# EAGLE design untitled (EAGLE 9.6.2)
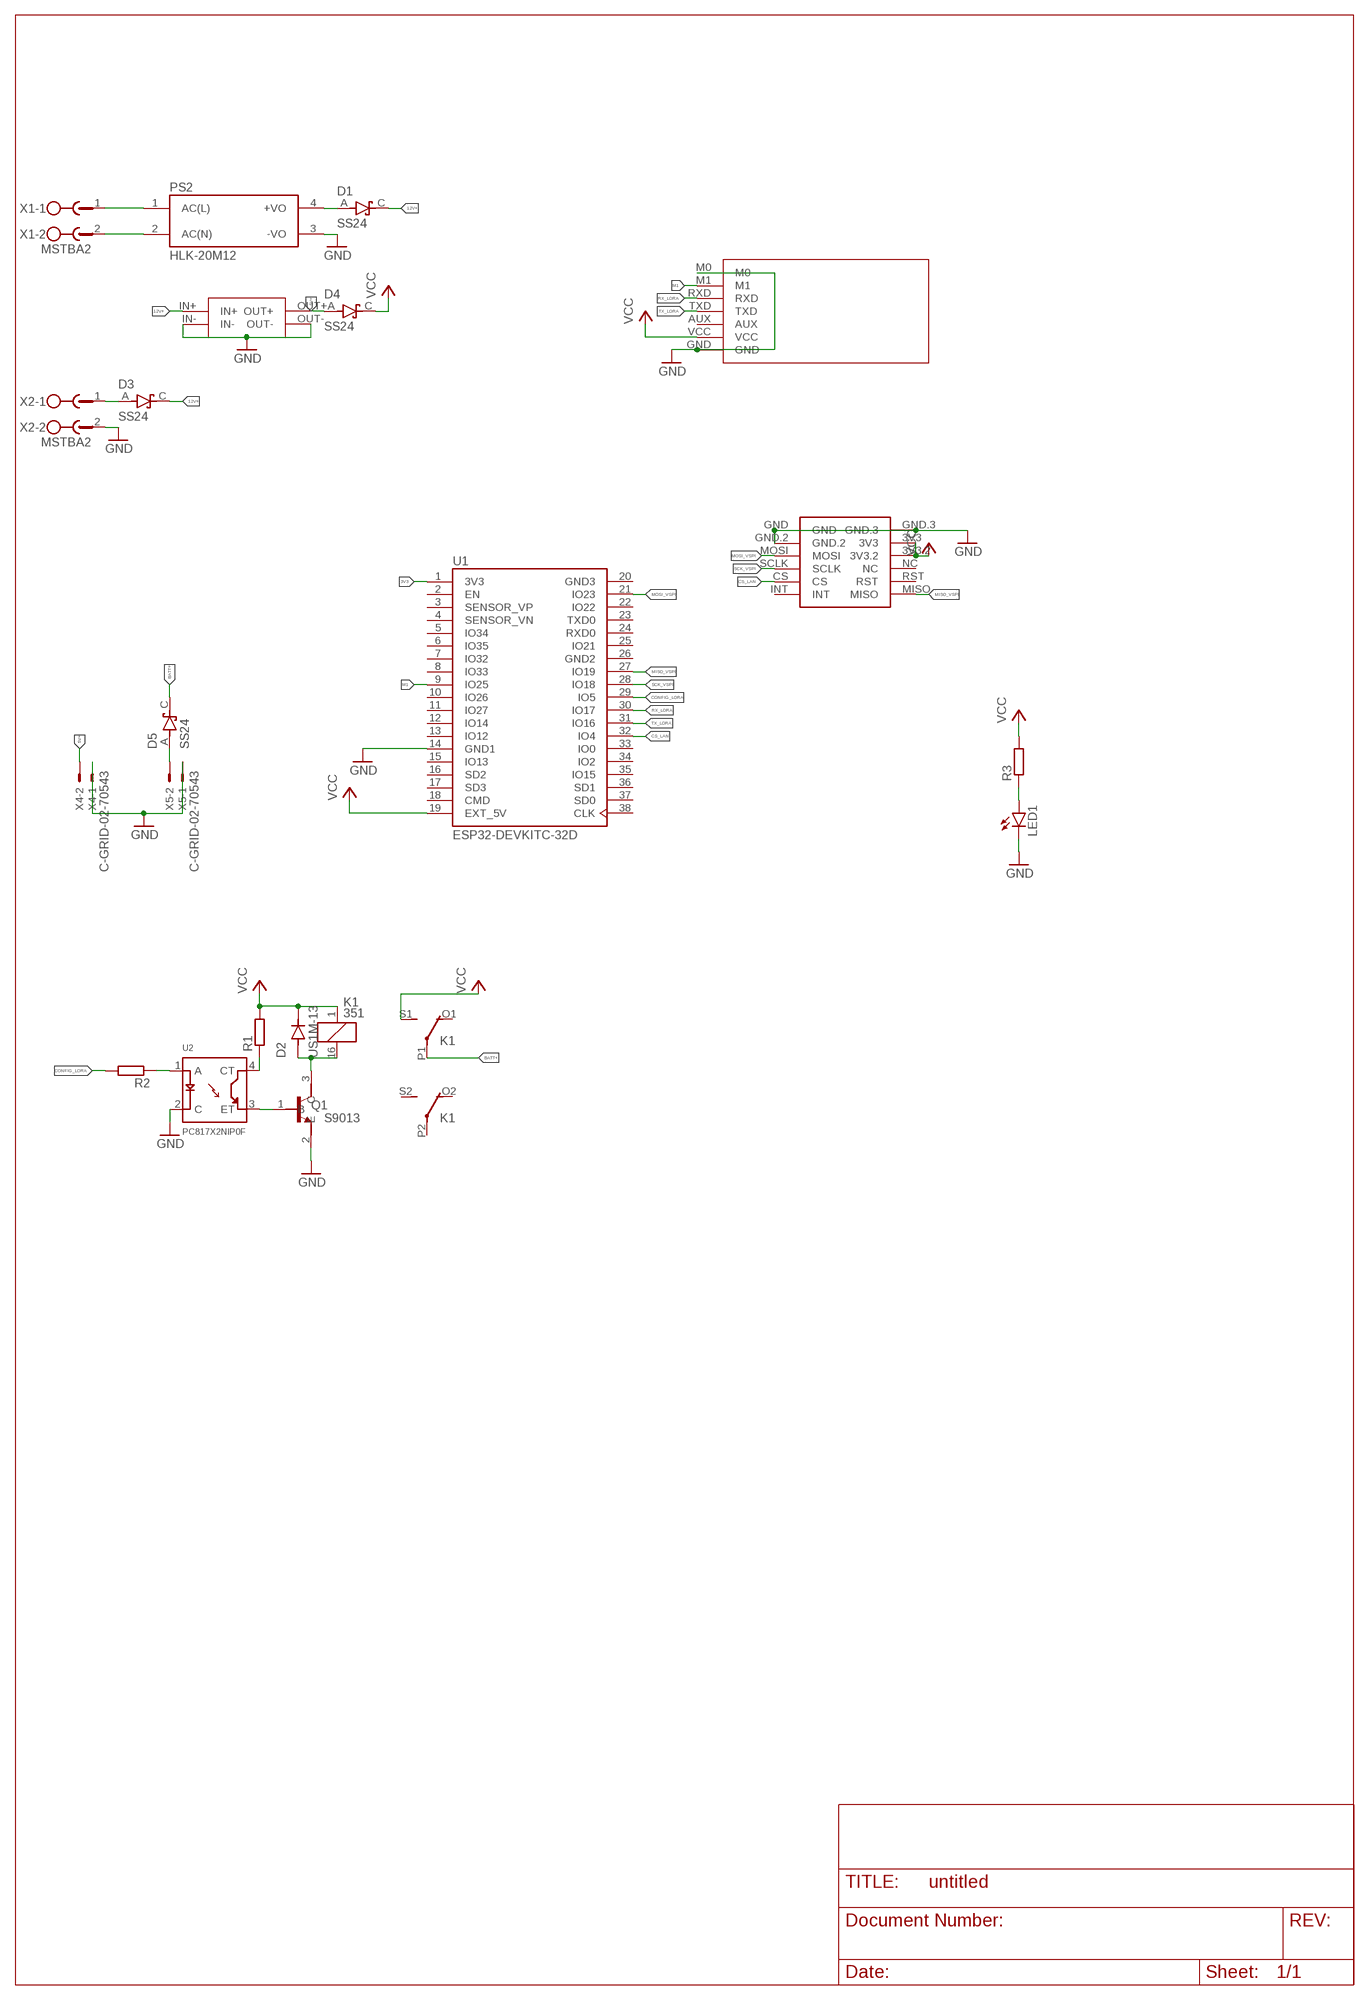
[diagram p0: schematic, sheet 1]

## Parts
D1  SS24  [DIOM5336X265N]
D2  US1M-13  [DIOM5226X240N]
D3  SS24  [DIOM5336X265N]
D4  SS24  [DIOM5336X265N]
D5  SS24  [DIOM5336X265N]
EBYTEE220-900T22D1  EBYTEE220-900T22D  [EBYTEE220-900T22D]
K1  351  [351]
LED1  TLLY4400  [LED3MM]
MINI1  MINI560  [MINI560]
PS2  HLK-20M12  [CONV_HLK-20M12]
Q1  S9013  [SOT95P240X120-3N]
R1  R-EU_R0805  [R0805]
R2  R-EU_R0805  [R0805]
R3  R-EU_R0805  [R0805]
U1  ESP32-DEVKITC-32D  [MODULE_ESP32-DEVKITC-32D]
U2  PC817X2NIP0F  [SOT254P975X400-4N]
U$1  MINI_W5500  [MINI_W5500]
X1  MSTBA2  [MSTBA2]
X2  MSTBA2  [MSTBA2]
X4  C-GRID-02-70543  [70543-02]
X5  C-GRID-02-70543  [70543-02]

## Nets
3V3: U1.1(3V3)
5V+: D4.A MINI1.OUT+ X4.2
12V+: D1.C(K) D3.C(K) MINI1.IN+
BATT+: D5.C(K) K1.P1(2:P)
CONFIG_LORA: R2.2 U1.29(IO5)
CS_LAN: U1.32(IO4) U$1.CS
GND: EBYTEE220-900T22D1.GND EBYTEE220-900T22D1.M0 LED1.K(C) MINI1.IN- MINI1.OUT- PS2.3(-VO) Q1.2(E) U1.14(GND1) U2.2(C) U$1.GND U$1.GND.2 U$1.GND.3 X2.2 X4.1 X5.1
M1: EBYTEE220-900T22D1.M1 U1.9(IO25)
MISO_VSPI: U1.27(IO19) U$1.MISO
MOSI_VSPI: U1.21(IO23) U$1.MOSI
N$1: PS2.1(AC(L)) X1.1
N$2: PS2.2(AC(N)) X1.2
N$3: D1.A PS2.4(+VO)
N$4: R2.1 U2.1(A)
N$5: D3.A X2.1
N$6: D2.A K1.16 Q1.3(C)
N$7: Q1.1(B) U2.3(ET)
N$8: R1.1 U2.4(CT)
N$10: LED1.A R3.1
N$12: D5.A X5.2
RX_LORA: EBYTEE220-900T22D1.RXD U1.30(IO17)
SCK_VSPI: U1.28(IO18) U$1.SCLK
TX_LORA: EBYTEE220-900T22D1.TXD U1.31(IO16)
VCC: D2.C(K) D4.C(K) EBYTEE220-900T22D1.VCC K1.1 K1.S1(2:S) R1.2 R3.2 U1.19(EXT_5V) U$1.3V3 U$1.3V3.2
Unconnected: EBYTEE220-900T22D1.AUX K1.O1(2:O) K1.O2(3:O) K1.P2(3:P) K1.S2(3:S) U1.2(EN) U1.3(SENSOR_VP) U1.4(SENSOR_VN) U1.5(IO34) U1.6(IO35) U1.7(IO32) U1.8(IO33) U1.10(IO26) U1.11(IO27) U1.12(IO14) U1.13(IO12) U1.15(IO13) U1.16(SD2) U1.17(SD3) U1.18(CMD) U1.22(IO22) U1.23(TXD0) U1.24(RXD0) U1.25(IO21) U1.33(IO0) U1.34(IO2) U1.35(IO15) U1.36(SD1) U1.37(SD0) U1.38(CLK) U$1.INT U$1.NC U$1.RST

## Power pins joined to a net without a drawn wire
GND2: U1.26(GND2)
GND3: U1.20(GND3)

## Library data of the parts
D1 D3-D5 = SS24:SS24: Diode Schottky 40V 2A Surface Mount DO-214AA (SMB) Check availability <https://pricing.snapeda.com/parts/SS24/ON%20Semiconductor/view-part?ref=eda>; AVAILABILITY: In Stock; CHECK_PRICES: https://www.snapeda.com/parts/SS24/Onsemi/view-part/?ref=eda; DESCRIPTION: Diode Schottky 40V 2A Surface Mount DO-214AA (SMB); MF: ON Semiconductor; MP: SS24; PACKAGE: DO-214AA ON Semiconductor; PRICE: None; SNAPEDA_LINK: https://www.snapeda.com/parts/SS24/Onsemi/view-part/?ref=snap
D2 = US1M-13:US1M-13: Diode, Fast Recovery, 1a, 1kv, Do-214ac-2, Full Reel Check availability <https://pricing.snapeda.com/parts/US1M-13/Diodes%20Incorporated/view-part?ref=eda>; AVAILABILITY: In Stock; DESCRIPTION: Diode Standard 1000 V 1A Surface Mount SMA; MF: Diodes Incorporated; MP: US1M-13; PACKAGE: DO-214AC-214 Diodes Incorporated; PRICE: None; PURCHASE-URL: https://pricing.snapeda.com/search/part/US1M-13/?ref=eda
EBYTEE220-900T22D1 = EByte E220-900T22D:EBYTEE220-900T22D
K1 = relay:351: RELAY 2 x switch, Omron; OC_FARNELL: unknown; OC_NEWARK: unknown
LED1 = led:TLLY4400: Low Current (2mA) LED 3 mm Tinted Diffused Package color YELLOW Source: Data sheet <http://www.farnell.com/datasheets/391098.pdf>; MF: VISHAY SEMICONDUCTOR; OC_FARNELL: 1612439
MINI1 = MINI560:MINI560
PS2 = HLK-20M12:HLK-20M12: Check availability <https://pricing.snapeda.com/parts/HLK-20M12/Hi-link/view-part?ref=eda>; AVAILABILITY: Not in stock; CHECK_PRICES: https://www.snapeda.com/parts/HLK-20M12/Hi-link/view-part/?ref=eda; DESCRIPTION: 20W ultra-small series module power supply; MF: Hi-link; MP: HLK-20M12; PACKAGE: Non-Standard Hi-link; PRICE: None; SNAPEDA_LINK: https://www.snapeda.com/parts/HLK-20M12/Hi-link/view-part/?ref=snap
Q1 = S9013:S9013: SMD Transistors NPN 25V-500mA Check availability <https://pricing.snapeda.com/parts/S9013/JCET/view-part?ref=eda>; AVAILABILITY: In Stock; DESCRIPTION: Bipolar (BJT) Transistor NPN 20V 500mA 625mW Through Hole TO-92-3; MF: JCET; MP: S9013; PACKAGE: SOT-23-3 JCET; PRICE: None; PURCHASE-URL: https://pricing.snapeda.com/search/part/S9013/?ref=eda
R1-R3 = rcl:R-EU_: RESISTOR, European symbol; SPICEPREFIX: R
U1 = ESP32-DEVKITC-32D:ESP32-DEVKITC-32D: Eval Board For Esp-Wroom-32 Check availability <https://pricing.snapeda.com/parts/ESP32-DEVKITC-32D/Espressif%20Systems/view-part?ref=eda>; AVAILABILITY: In Stock; DESCRIPTION: WiFi Development Tools (802.11) ESP32 General Development Kit, ESP32-WROOM-32D on the board; MF: Espressif Systems; MP: ESP32-DEVKITC-32D; PACKAGE: None; PRICE: None; PURCHASE-URL: https://pricing.snapeda.com/search/part/ESP32-DEVKITC-32D/?ref=eda
U2 = PC817X2NIP0F:PC817X2NIP0F: PC817 Series 1 Channel 80 V 5000 Vrms General Purpose Photocoupler - DIP-4 Check availability <https://pricing.snapeda.com/parts/PC817X2NIP0F/Sharp%20Microelectronics/view-part?ref=eda>; AVAILABILITY: Not in stock; DESCRIPTION: Optoisolator Transistor Output 5000Vrms 1 Channel 4-SMD; MF: Sharp Microelectronics; MP: PC817X2NIP0F; PACKAGE: SMD-4 Sharp Microelectronics; PRICE: None
U$1 = ethernet-mikroavr:MINI_W5500: MINI ETHERNET W5500, CREATE BY MIKROAVR.COM
X1 X2 = con-phoenix-508:MSTBA2: PHOENIX; MF: FARNELL; MPN: 1757242; OC_FARNELL: 3705171; OC_NEWARK: 71C4161
X4 X5 = con-molex:C-GRID-02: CONNECTOR wire to board 2.54 mm (0.100") pitch header; MF: MOLEX; OC_FARNELL: unknown; OC_NEWARK: unknown

## Board
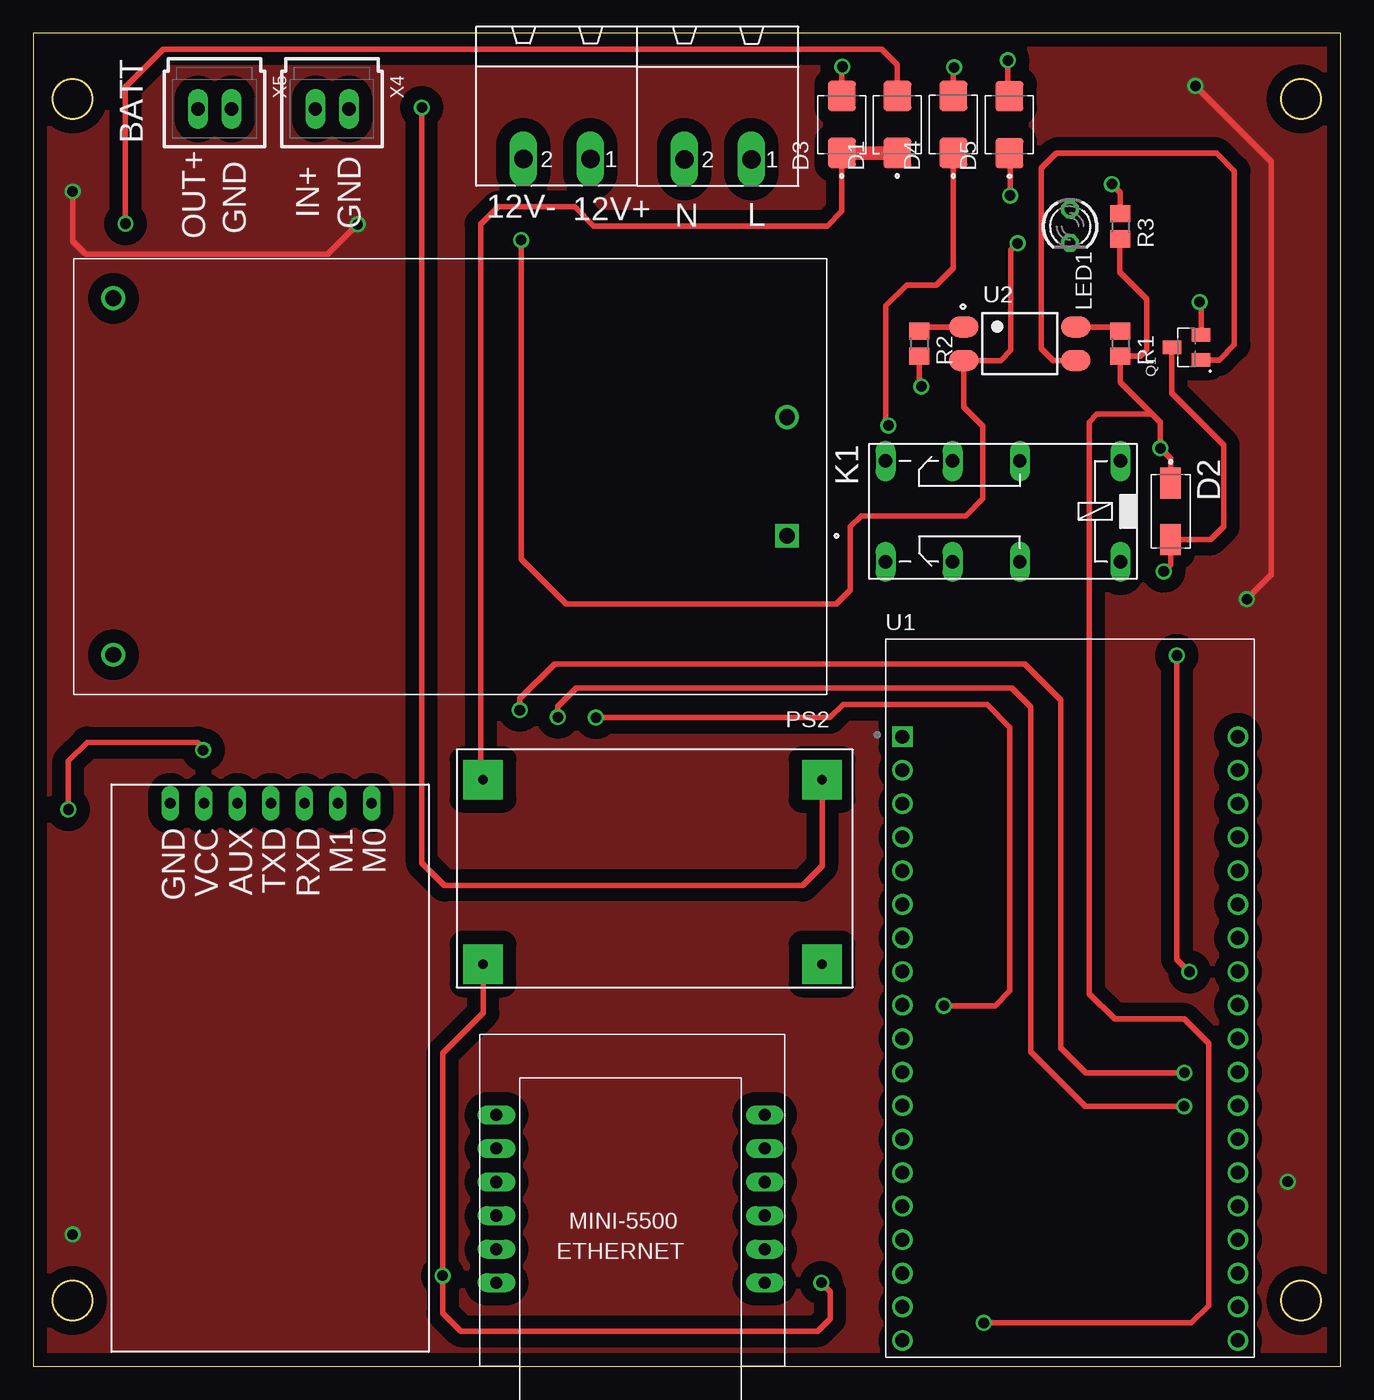
[diagram p1: board, top side]
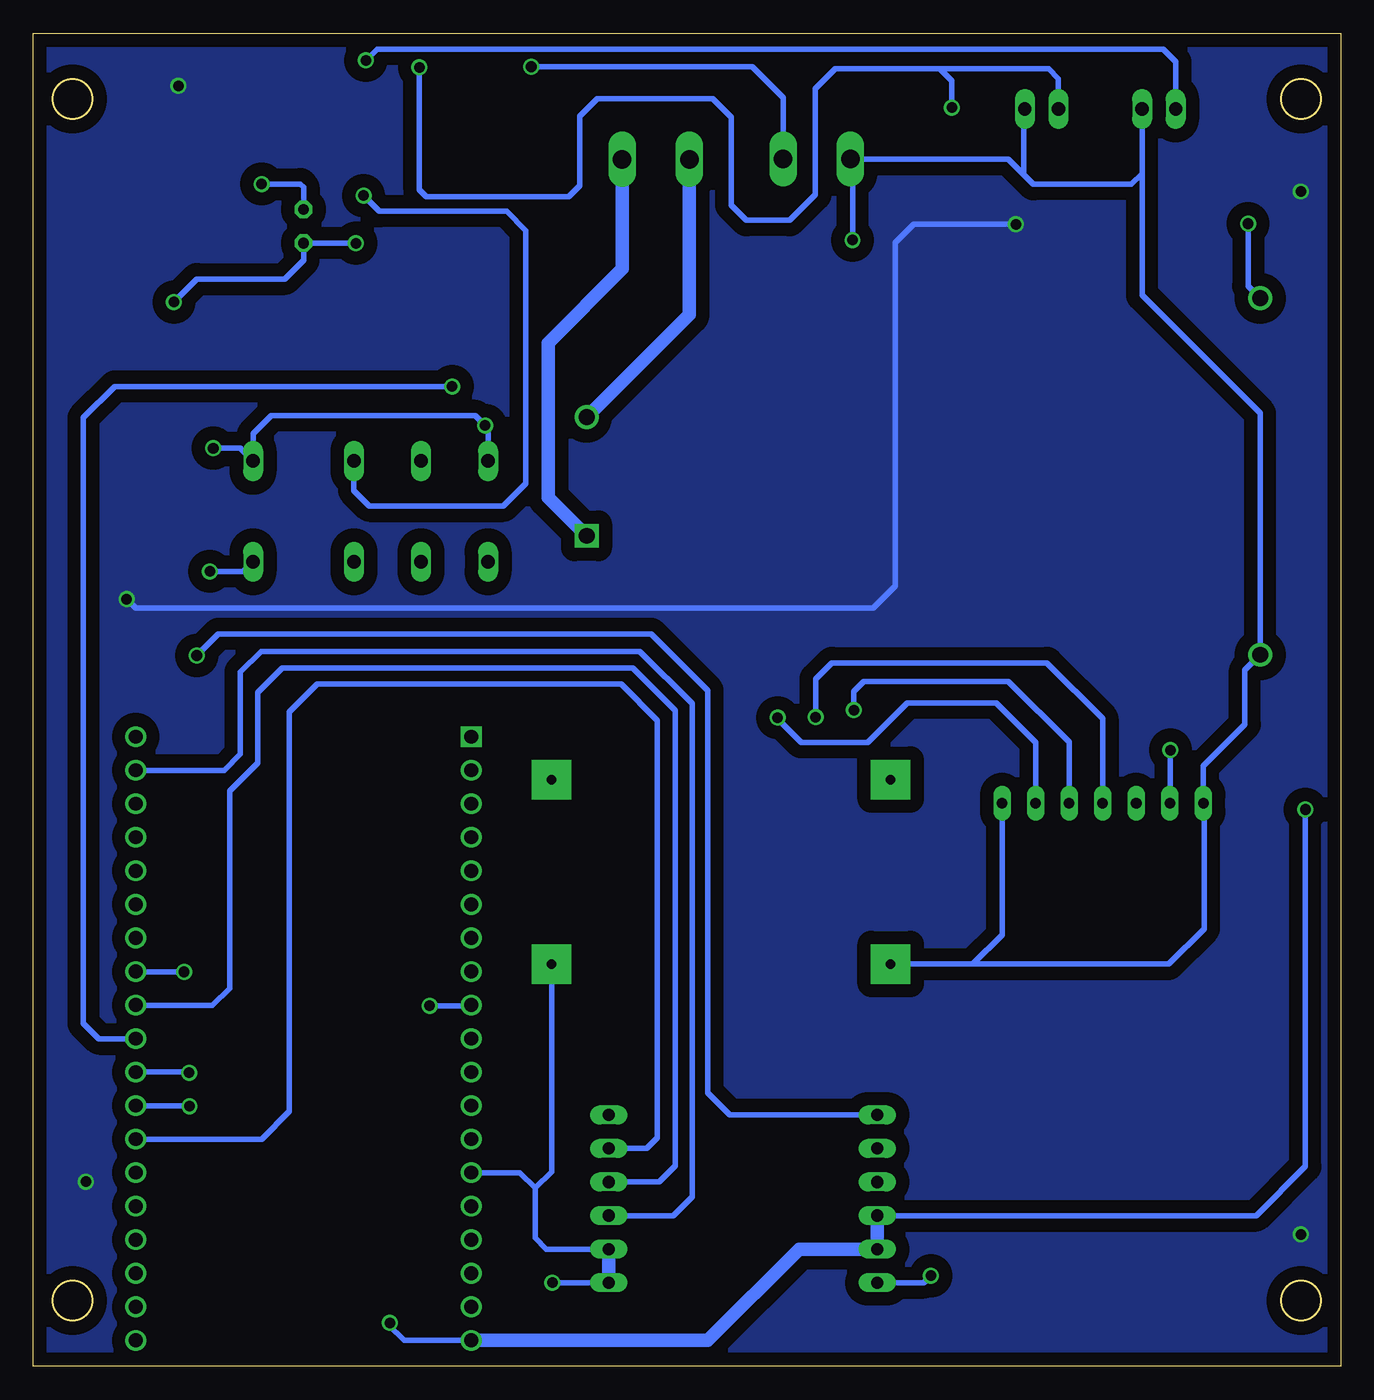
[diagram p2: board, bottom side, seen from below]

Size 99 x 101 mm. Coordinates in mm from the lower left corner, seen from the top.
Outline: 0,0 99,0 99,101 0,101 0,0
Outline: circle at 3,96 radius 1.5
Outline: circle at 96,5 radius 1.5
Outline: circle at 96,96 radius 1.5
Outline: circle at 3,5 radius 1.5
Copper layers (1*16): Top 0.035mm / dielectric 1.5mm / Bottom 0.035mm
Design rules "default": minimum track width 6mil, minimum drill 0.35mm, track to track 6mil, track to pad 6mil, pad to pad 6mil, via to via 6mil, smd to smd 6mil, copper to edge 40mil, drill to drill 6mil, minimum pad ring 10mil, minimum via ring 8mil, stop-mask expansion 4mil, vias tented up to drill 0mil, thermal gap 10mil

### Footprints (pad centres in the part's own frame; a part is rotated, then mirrored left to right if it is on the bottom)
DIOM5336X265N = smd 2.29 x 2.12: A 2.16,0; C -2.16,0
DIOM5226X240N = smd 2.33 x 1.55: A 2.135,0; C -2.135,0
EBYTEE220-900T22D = drill 0.8 pad 1.27 long: AUX -4.56,-10.98; GND -4.56,-16.06; M0 -4.56,-0.82; M1 -4.56,-3.36; RXD -4.56,-5.9; TXD -4.56,-8.44; VCC -4.56,-13.52
351 = drill 1.016 long: 1 -3.81,-3.81; 16 -3.81,3.81; O1 8.89,-3.81; O2 8.89,3.81; P1 3.81,-3.81; P2 3.81,3.81; S1 13.97,-3.81; S2 13.97,3.81
LED3MM = drill 0.813 octagon: A -1.27,0; K 1.27,0
MINI560 = drill 0.7 pad 3 square: IN+ 0,-1.27; IN- 0,-15.24; OUT+ 25.67,-1.27; OUT- 25.67,-15.24
CONV_HLK-20M12 = drill 1.2 square: 1 -25.5,4.5 | drill 1.2: 2 -25.5,-4.5; 3 25.5,13.5; 4 25.5,-13.5
SOT95P240X120-3N = smd 1 x 1.4: 1 -0.95,-1.1; 2 0.95,-1.1; 3 0,1.1
R0805 = smd 1.3 x 1.5: 1 -0.95,0; 2 0.95,0
MODULE_ESP32-DEVKITC-32D = drill 1.04 square: 1 -12.7,19.76 | drill 1.04: 2 -12.7,17.22; 3 -12.7,14.68; 4 -12.7,12.14; 5 -12.7,9.6; 6 -12.7,7.06; 7 -12.7,4.52; 8 -12.7,1.98; 9 -12.7,-0.56; 10 -12.7,-3.1; 11 -12.7,-5.64; 12 -12.7,-8.18; 13 -12.7,-10.72; 14 -12.7,-13.26; 15 -12.7,-15.8; 16 -12.7,-18.34; 17 -12.7,-20.88; 18 -12.7,-23.42; 19 -12.7,-25.96; 20 12.7,19.76; 21 12.7,17.22; 22 12.7,14.68; 23 12.7,12.14; 24 12.7,9.6; 25 12.7,7.06; 26 12.7,4.52; 27 12.7,1.98; 28 12.7,-0.56; 29 12.7,-3.1; 30 12.7,-5.64; 31 12.7,-8.18; 32 12.7,-10.72; 33 12.7,-13.26; 34 12.7,-15.8; 35 12.7,-18.34; 36 12.7,-20.88; 37 12.7,-23.42; 38 12.7,-25.96
SOT254P975X400-4N = smd 2.25 x 1.6: 1 -4.25,1.27; 2 -4.25,-1.27; 3 4.25,-1.27; 4 4.25,1.27
MINI_W5500 = drill 0.914 long: 3V3 21.844,-8.89; 3V3.2 21.844,-11.43; CS 1.524,-16.51; GND 1.524,-6.35; GND.2 1.524,-8.89; GND.3 21.844,-6.35; INT 1.524,-19.05; MISO 21.844,-19.05; MOSI 1.524,-11.43; NC 21.844,-13.97; RST 21.844,-16.51; SCLK 1.524,-13.97
MSTBA2 = drill 1.397 long: 1 -2.54,5.08; 2 2.54,5.08
70543-02 = drill 1.016 long: 1 -1.27,0; 2 1.27,0

### Placement (x,y rotation side)
D1  65.44,94.07 90 top
D2  86.14,64.77 270 top
D3  61.23,94.07 90 top
D4  69.68,94.07 90 top
D5  73.92,94.06 90 top
EBYTEE220-900T22D1  26.45,38.1 270 top
K1  78.52,64.77 180 top
LED1  78.52,86.36 270 top
MINI1  34.07,45.72 0 top
PS2  31.58,67.41 180 top
Q1  87.34,77.19 90 top
R1  82.33,77.47 270 top
R2  67.09,77.47 270 top
R3  82.33,86.36 270 top
U1  78.52,27.94 0 top
U2  74.71,77.47 0 top
U$1  56.93,0 180 top
X1  51.85,96.52 180 top
X2  39.66,96.54 180 top
X4  22.64,95.25 180 top
X5  13.75,95.25 180 top

### Tracks (layer width: path | path; a pad name or v marks a point on that pad's centre or on a via)
5V+  (via drill 0.8 pad 1.1)
  Top 0.406: v69.74,98.4 69.68,98.33 D4.A | MINI1.OUT+ 59.74,37.9 58.26,36.42 31.14,36.42 29.44,38.13 v29.44,95.36
  Bottom 0.406: X4.2 21.37,97.55 22.11,98.29 30.33,98.29 | 30.33,98.29 38.24,98.29 39.77,96.76 39.77,88.75 41.7,86.82 44.98,86.82 46.14,87.97 46.14,94.63 47.52,96.02 56.27,96.02 57.6,94.69 57.6,89.43 58.43,88.59 69.21,88.59 69.74,89.13 v69.74,98.4 | v29.44,95.36 29.44,97.39 30.33,98.29
12V+
  Top 0.406: D3.C 61.23,87.49 60.12,86.38 42.47,86.38 41,87.84 35.21,87.84 33.9,86.53 33.9,44.62 MINI1.IN+
  Top 1.016: D1.C D3.C
BATT+  (via drill 0.8 pad 1.1)
  Top 0.406: v73.97,88.69 73.97,91.85 D5.C
  Bottom 0.406: K1.P1 74.71,66.36 73.54,65.18 63.38,65.18 61.69,66.88 61.69,86.03 63.15,87.5 72.78,87.5 v73.97,88.69
CONFIG_LORA  (via drill 0.8 pad 1.1)
  Top 0.406: R2.2 67.09,74.4 v67.27,74.23
  Bottom 0.406: v67.27,74.23 92.81,74.23 95.18,71.86 95.18,25.99 94.01,24.82 91.25,24.82 U1.29
CS_LAN
  Bottom 0.406: U$1.CS 52.52,16.51 51.72,17.31 51.72,48.93 54.47,51.68 77.48,51.68 79.59,49.58 79.59,19.31 81.68,17.22 U1.32
GND  (via drill 0.8 pad 1.1)
  Top 0.406: v74.55,85.07 74.03,84.56 74.03,76.97 73.27,76.2 U2.2 70.46,72.68 71.91,71.24 71.91,65.72 70.62,64.43 62.7,64.43 61.88,63.61 61.88,58.8 60.82,57.74 40.36,57.74 36.95,61.14 v36.95,85.32 | Q1.2 88.44,80.51 v88.33,80.62 | MINI1.IN- 34.09,30.46 34.09,26.79 31.02,23.72 v31.02,6.88 31.02,4.04 32.39,2.67 59.42,2.67 60.36,3.61 60.36,5.67 v59.68,6.35
  Bottom 0.406: U$1.GND.2 60.13,8.89 60.97,9.73 60.97,13.52 | U1.14 62.13,14.68 60.97,13.52 | v74.55,85.07 78.5,85.07 | 78.5,85.07 LED1.K | v88.33,80.62 86.59,82.36 79.92,82.36 78.5,83.78 78.5,85.07 | MINI1.IN- 27.84,30.48 | EBYTEE220-900T22D1.M0 25.63,32.69 27.84,30.48 | 27.84,30.48 13.02,30.48 10.34,33.16 10.34,42.61 EBYTEE220-900T22D1.GND 10.39,45.49 7.24,48.64 7.24,52.75 PS2.3 6.08,72.21 15.02,81.14 15.02,90.36 | 15.02,90.36 X5.1 | 15.02,90.36 15.84,89.54 23.25,89.54 23.99,90.27 | 23.99,90.27 23.99,95.17 X4.1 | MINI1.OUT- 59.74,14.75 60.97,13.52 | 23.99,90.27 25.17,91.46 X2.2 36.95,91.29 v36.95,85.32 | U$1.GND.3 31.55,6.35 v31.02,6.88 | v59.68,6.35 U$1.GND
  Bottom 1.016: U$1.GND U$1.GND.2
GND1  (via drill 0.8 pad 1.1)
  Top 0.406: v3,89 3,85.22 3.98,84.24 22.32,84.24 v24.58,86.51 | v91.91,58.12 93.76,59.97 93.76,91.24 v88,97
  Bottom 0.406: v24.58,86.51 32.34,86.51 33.72,85.12 33.72,59.12 35.4,57.44 91.24,57.44 v91.91,58.12
  other vias: 3,10 95,14
  pour Top (isolate 1.016): 0,0 0,101 99,101 99,0 1,0
  pour Bottom (isolate 1.016): 0,0 0,101 99,101 99,0
M1  (via drill 0.8 pad 1.1)
  Top 0.406: v42.62,49.14 60.34,49.14 61.33,50.13 72.24,50.13 73.96,48.41 73.96,28.43 72.84,27.32 v68.97,27.32
  Bottom 0.406: EBYTEE220-900T22D1.M1 23.09,47.28 26.08,50.27 32.82,50.27 35.82,47.27 40.84,47.27 42.67,49.09 | 42.67,49.09 | 42.67,49.09 v42.62,49.14 | v68.97,27.32 65.88,27.32 U1.9
MISO_VSPI  (via drill 0.8 pad 1.1)
  Top 0.406: v86.6,53.85 86.6,30.84 v87.55,29.89
  Bottom 0.406: U$1.MISO 46.26,19.05 47.92,20.71 47.92,51.2 52.2,55.48 84.97,55.48 v86.6,53.85 | v87.55,29.89 91.19,29.89 U1.27
MOSI_VSPI
  Bottom 0.406: U$1.MOSI 50.51,11.43 49.09,12.85 49.09,50.21 53.06,54.17 81.74,54.17 83.3,52.61 83.3,46.4 84.54,45.16 U1.21
N$1
  Bottom 1.016: PS2.1 60,65.83 60,77.52 54.37,83.15 54.37,91.42 X1.1
N$2
  Bottom 1.016: PS2.2 49.31,79.69 X1.2
N$3  (via drill 0.8 pad 1.1)
  Top 0.406: D1.A 65.44,98.59 64.25,99.78 9.88,99.78 7,96.91 v7,86.56
  Bottom 0.406: v7,86.56 7,81.83 PS2.4
N$4
  Top 0.406: U2.1 67.41,78.74 R2.1
N$5  (via drill 0.8 pad 1.1)
  Top 0.406: D3.A 61.23,98.4 v61.28,98.44
  Bottom 0.406: v61.28,98.44 44.54,98.44 42.2,96.1 X2.1
N$6  (via drill 0.8 pad 1.1)
  Top 0.406: v85.61,60.23 86.14,60.76 D2.A 89.17,62.63 90.14,63.61 90.14,69.8 86.22,73.73 86.22,77.17 Q1.3
  Bottom 0.406: K1.16 83.06,60.23 v85.61,60.23
N$7
  Top 0.406: Q1.1 89.8,76.24 90.96,77.39 90.96,90.55 89.61,91.89 77.48,91.89 77.09,91.51 76.91,91.33 76.34,90.75 76.34,77.11 77.25,76.2 U2.3
N$8
  Top 0.406: U2.4 82.01,78.74 R1.1
N$10  (via drill 0.8 pad 1.1)
  Top 0.406: R3.1 82.33,88.92 v81.69,89.56
  Bottom 0.406: v81.69,89.56 78.76,89.56 78.52,89.31 LED1.A
N$12  (via drill 0.8 pad 1.1)
  Top 0.406: v73.8,98.93 73.8,96.34 D5.A
  Bottom 0.406: X5.2 12.48,98.82 13.44,99.78 72.95,99.78 v73.8,98.93
RX_LORA  (via drill 0.8 pad 1.1)
  Top 0.406: v87.18,22.25 79.7,22.25 77.83,24.12 77.83,50.47 75.07,53.22 39.5,53.22 36.85,50.58 v36.85,49.72
  Bottom 0.406: U1.30 87.23,22.3 v87.18,22.25 | v36.85,49.72 36.85,51.14 36.1,51.9 25.16,51.9 20.55,47.28 EBYTEE220-900T22D1.RXD
SCK_VSPI
  Bottom 0.406: U$1.SCLK 51.59,13.97 50.36,15.19 50.36,49.7 53.58,52.91 80.13,52.91 82,51.04 82,45.7 84.12,43.59 84.12,28.64 85.42,27.33 91.17,27.33 U1.28
TX_LORA  (via drill 0.8 pad 1.1)
  Top 0.406: v87.15,19.71 79.65,19.71 75.54,23.82 75.54,49.94 74.11,51.37 41.12,51.37 39.74,49.99 v39.74,49.18
  Bottom 0.406: U1.31 87.2,19.76 v87.15,19.71 | EBYTEE220-900T22D1.TXD 18.01,49.07 22.23,53.3 38.52,53.3 39.74,52.08 v39.74,49.18
VCC  (via drill 0.8 pad 1.1)
  Top 0.406: D2.C 86.14,68.77 v85.36,69.55 85.36,71.52 84.74,72.14 | 84.74,72.14 82.33,74.55 R1.2 83.85,76.52 84.34,77.01 84.34,80.84 82.3,82.88 82.3,85.38 R3.2 | D4.C 69.68,83.2 68.39,81.92 66.16,81.92 64.58,80.34 64.58,71.46 v64.76,71.28 | v2.67,42.19 2.67,45.86 4.09,47.28 12.44,47.28 12.93,46.79 12.93,46.74 v12.88,46.69 | v71.98,3.3 87.7,3.3 89,4.6 89,24.48 87.17,26.31 81.89,26.31 79.97,28.23 79.97,71.54 80.56,72.14 84.74,72.14
  Bottom 0.406: v85.36,69.55 83.3,69.55 K1.1 82.33,70.65 80.96,72.02 65.5,72.02 v64.76,71.28 64.55,71.06 K1.S1 | U$1.3V3.2 6.4,11.43 2.67,15.16 v2.67,42.19 | v12.88,46.69 12.88,42.71 EBYTEE220-900T22D1.VCC | U1.19 70.91,1.98 72.11,3.18 v71.98,3.3
  Bottom 1.016: U$1.3V3.2 U$1.3V3 41,8.89 47.92,1.98 U1.19

### Text on the board
tNames: BATT | IN+ | 12V- | 12V+ | GND | GND | N | L | OUT+